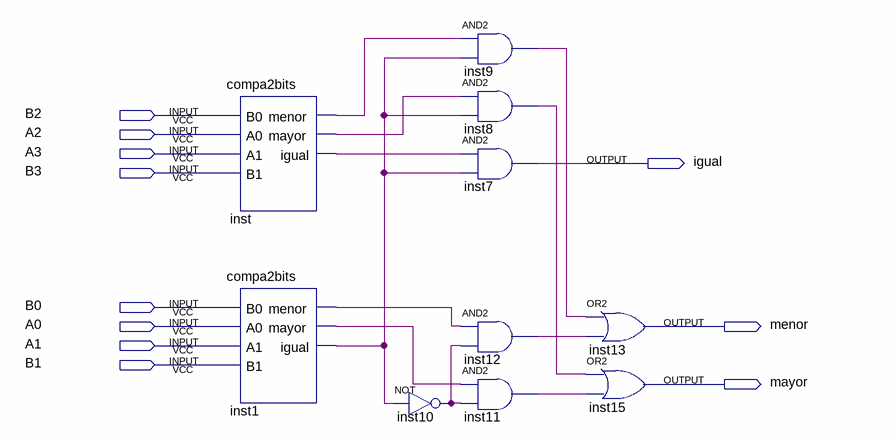
[diagram p0: schematic sheet]
// Quartus schematic compa4bits.bdf as structural Verilog: 10 symbols, 11 pins
module compa4bits (
  input  B2,
  input  A2,
  input  A3,
  input  B3,
  input  B0,
  input  A0,
  input  A1,
  input  B1,
  output igual,
  output menor,
  output mayor
);

  wire inst1_igual, inst1_mayor, inst1_menor, inst8_out, inst9_out, inst10_out, inst11_out, inst12_out,
       inst_igual, inst_mayor, inst_menor;

  compa2bits inst (.B0(B2), .A0(A2), .A1(A3), .B1(B3), .menor(inst_menor), .mayor(inst_mayor), .igual(inst_igual));
  compa2bits inst1 (.B0(B0), .A0(A0), .A1(A1), .B1(B1), .menor(inst1_menor), .mayor(inst1_mayor), .igual(inst1_igual));
  not inst10 (inst10_out, inst1_igual);
  and inst9 (inst9_out, inst_menor, inst1_igual);
  and inst8 (inst8_out, inst_mayor, inst1_igual);
  and inst7 (igual, inst_igual, inst1_igual);
  and inst12 (inst12_out, inst1_menor, inst10_out);
  and inst11 (inst11_out, inst1_mayor, inst10_out);
  or inst13 (menor, inst9_out, inst12_out);
  or inst15 (mayor, inst8_out, inst11_out);
endmodule
